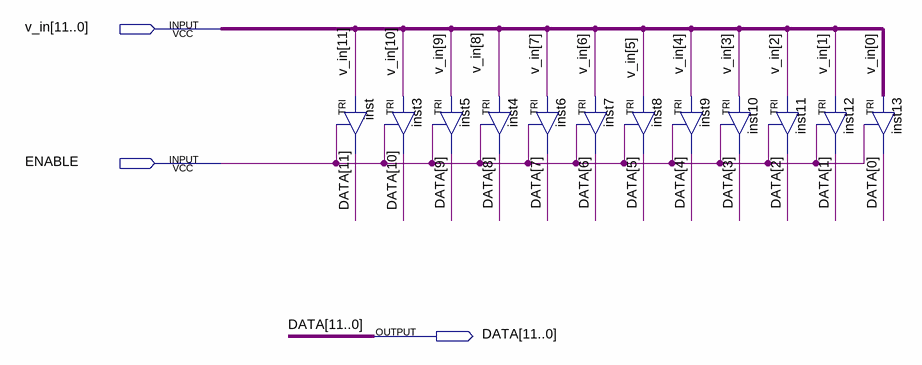
[diagram p0: schematic sheet]
// Quartus schematic tristate12.bdf as structural Verilog: 12 symbols, 3 pins
module tristate12 (
  input  [11:0] v_in,
  input  ENABLE,
  output [11:0] DATA
);

  TRI inst (.IN(v_in[11]), .OE(ENABLE), .OUT(DATA[11]));
  TRI inst3 (.IN(v_in[10]), .OE(ENABLE), .OUT(DATA[10]));
  TRI inst5 (.IN(v_in[9]), .OE(ENABLE), .OUT(DATA[9]));
  TRI inst4 (.IN(v_in[8]), .OE(ENABLE), .OUT(DATA[8]));
  TRI inst6 (.IN(v_in[7]), .OE(ENABLE), .OUT(DATA[7]));
  TRI inst7 (.IN(v_in[6]), .OE(ENABLE), .OUT(DATA[6]));
  TRI inst8 (.IN(v_in[5]), .OE(ENABLE), .OUT(DATA[5]));
  TRI inst9 (.IN(v_in[4]), .OE(ENABLE), .OUT(DATA[4]));
  TRI inst10 (.IN(v_in[3]), .OE(ENABLE), .OUT(DATA[3]));
  TRI inst11 (.IN(v_in[2]), .OE(ENABLE), .OUT(DATA[2]));
  TRI inst12 (.IN(v_in[1]), .OE(ENABLE), .OUT(DATA[1]));
  TRI inst13 (.IN(v_in[0]), .OE(ENABLE), .OUT(DATA[0]));
endmodule
